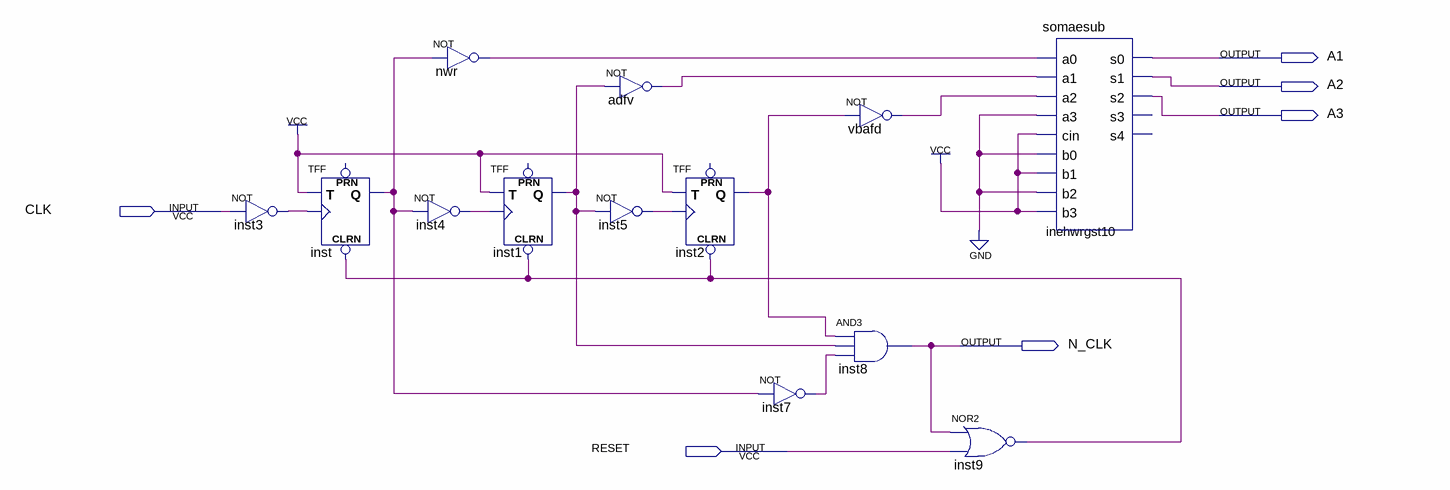
[diagram p0: schematic sheet]
// Quartus schematic minCounter.bdf as structural Verilog: 13 symbols, 6 pins
module minCounter (
  input  CLK,
  input  RESET,
  output A1,
  output A2,
  output A3,
  output N_CLK
);

  wire adfv_out, inst1_q, inst2_q, inst3_out, inst4_out, inst5_out, inst7_out, inst9_out, inst_q, nwr_out,
       vbafd_out;

  not inst3 (inst3_out, CLK);
  TFF inst (.CLRN(inst9_out), .T(1'b1), .CLK(inst3_out), .Q(inst_q));  // open: PRN
  not nwr (nwr_out, inst_q);
  not inst4 (inst4_out, inst_q);
  TFF inst1 (.CLRN(inst9_out), .T(1'b1), .CLK(inst4_out), .Q(inst1_q));  // open: PRN
  not adfv (adfv_out, inst1_q);
  not inst5 (inst5_out, inst1_q);
  TFF inst2 (.CLRN(inst9_out), .T(1'b1), .CLK(inst5_out), .Q(inst2_q));  // open: PRN
  not inst7 (inst7_out, inst_q);
  not vbafd (vbafd_out, inst2_q);
  and inst8 (N_CLK, inst2_q, inst1_q, inst7_out);
  nor inst9 (inst9_out, N_CLK, RESET);
  somaesub inehwrgst10 (
    .a0(nwr_out), .a1(adfv_out), .a2(vbafd_out), .a3(1'b0), .cin(1'b1), .b0(1'b0), .b1(1'b1), .b2(1'b0),
    .b3(1'b1), .s0(A1), .s1(A2), .s2(A3));  // open: s3, s4
endmodule
